# EAGLE design coolingcontrol (EAGLE 9.1.3)
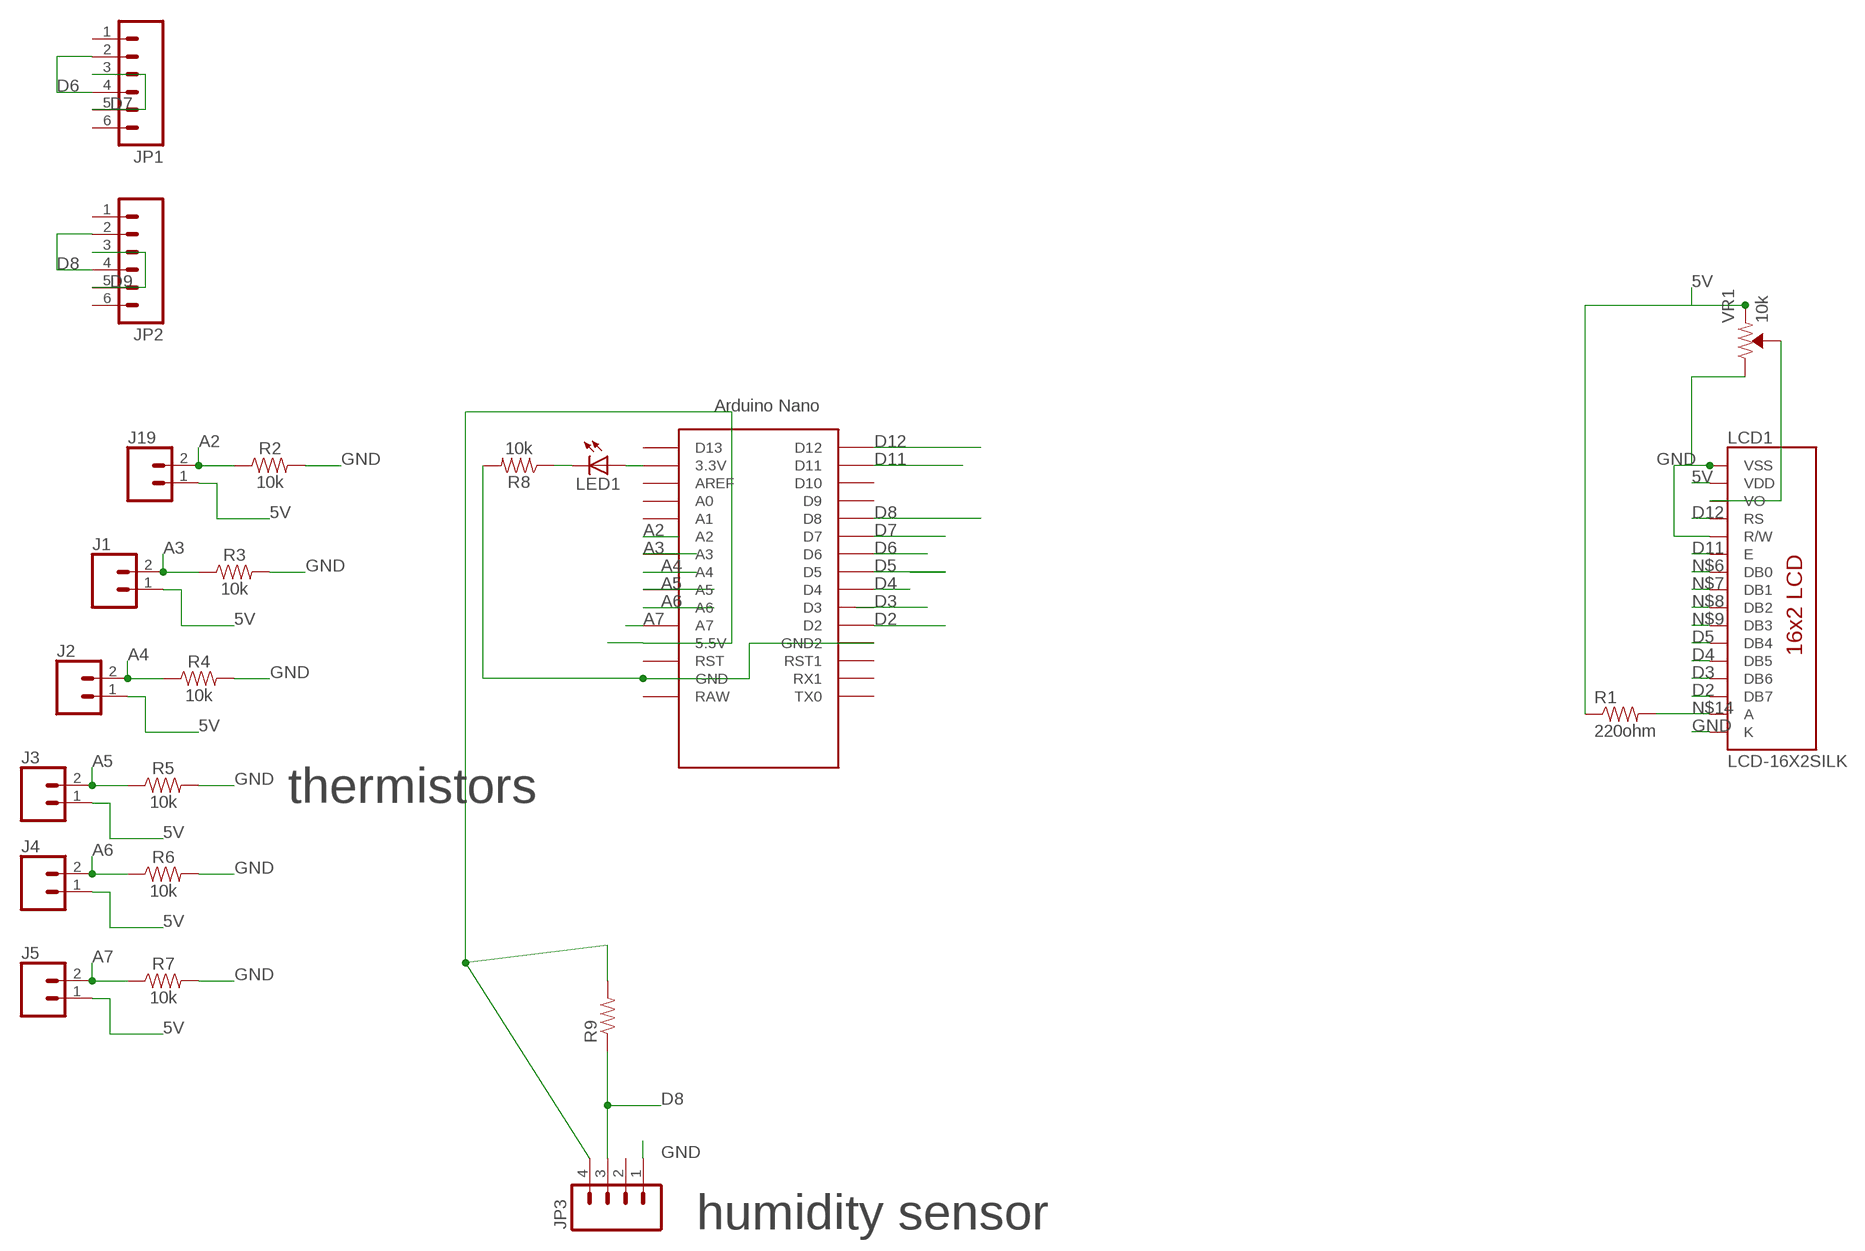
[diagram p0: schematic, sheet 1]

## Parts
J1  CONN_02-JST-2-PTH-NO_SILK  [JST-2-PTH-NS]
J2  CONN_02-JST-2-PTH-NO_SILK  [JST-2-PTH-NS]
J3  CONN_02-JST-2-PTH-NO_SILK  [JST-2-PTH-NS]
J4  CONN_02-JST-2-PTH-NO_SILK  [JST-2-PTH-NS]
J5  CONN_02-JST-2-PTH-NO_SILK  [JST-2-PTH-NS]
J19  CONN_02-JST-2-PTH-NO_SILK  [JST-2-PTH-NS]
JP1  M06POLAR  [MOLEX-1X6]
JP2  M06POLAR  [MOLEX-1X6]
JP3  M04PTH  [1X04]
LCD1  LCD-16X2SILK  [LCD-16X2]
LED1  LED5MM  [LED5MM]
R1  220ohm  RESISTORPTH1  [AXIAL-0.3]
R2  10k  10KOHM-HORIZ-1/4W-1%  [AXIAL-0.3]
R3  10k  10KOHM-HORIZ-1/4W-1%  [AXIAL-0.3]
R4  10k  10KOHM-HORIZ-1/4W-1%  [AXIAL-0.3]
R5  10k  10KOHM-HORIZ-1/4W-1%  [AXIAL-0.3]
R6  10k  10KOHM-HORIZ-1/4W-1%  [AXIAL-0.3]
R7  10k  10KOHM-HORIZ-1/4W-1%  [AXIAL-0.3]
R8  10k  10KOHM-HORIZ-1/4W-1%  [AXIAL-0.3]
R9  RESISTORPTH1  [AXIAL-0.3]
U$1  NANO  [NANO]
VR1  10k  TRIMPOT-PTH-10MM-KNOB-1/2W-10%  [TRIMPOT-PTH-3386U]

## Nets
5V: J1.1 J2.1 J3.1 J4.1 J5.1 J19.1 JP3.4 LCD1.2(VDD) R1.P$1 R9.P$2 U$1.5V(5.5V) VR1.1(CCW)
A2: J19.2 R2.P$1 U$1.A2
A3: J1.2 R3.P$1 U$1.A3
A4: J2.2 R4.P$1 U$1.A4
A5: J3.2 R5.P$1 U$1.A5
A6: J4.2 R6.P$1 U$1.A6
A7: J5.2 R7.P$1 U$1.A7
D2: LCD1.14(DB7) U$1.D2
D3: LCD1.13(DB6) U$1.D3
D4: LCD1.12(DB5) U$1.D4
D5: LCD1.11(DB4) U$1.D5
D6: JP1.2 JP1.4 U$1.D6
D7: JP1.3 JP1.5 U$1.D7
D8: JP2.2 JP2.4 JP3.3 R9.P$1 U$1.D8
D9: JP2.3 JP2.5
D11: LCD1.6(E) U$1.D11
D12: LCD1.4(RS) U$1.D12
GND: JP3.1 LCD1.1(VSS) LCD1.5(R/W) LCD1.16(K) R2.P$2 R3.P$2 R4.P$2 R5.P$2 R6.P$2 R7.P$2 R8.P$2 U$1.GND U$1.GND1(GND2) VR1.3(CW)
N$1: LCD1.3(VO) VR1.2(WIPER)
N$3: LED1.K(C) R8.P$1
N$4: LED1.A U$1.3.3V
N$6: LCD1.7(DB0)
N$7: LCD1.8(DB1)
N$8: LCD1.9(DB2)
N$9: LCD1.10(DB3)
N$14: LCD1.15(A) R1.P$2
Unconnected: JP1.1 JP1.6 JP2.1 JP2.6 JP3.2 U$1.A0 U$1.A1 U$1.AREF U$1.D9 U$1.D10 U$1.D13 U$1.ICSP1 U$1.ICSP2 U$1.ICSP3 U$1.ICSP4 U$1.ICSP5 U$1.ICSP6 U$1.RAW U$1.RST U$1.RST1 U$1.RX1 U$1.TX0

## Notes on the sheet
- thermistors
- humidity sensor

## Library data of the parts
J1-J5 J19 = SparkFun-Connectors:CONN_02: Multi connection point. Often used as Generic Header-pin footprint for 0.1 inch spaced/style header connections On any of the 0.1 inch spaced packages, you can populate with these: Break Away Headers - Straight <https://www.sparkfun.com/products/116> (PRT-00116) Break Away Male Headers - Right Angle <https://www.sparkfun.com/products/553> (PRT-00553) Female Headers <https://www.sparkfun.com/products/115> (PRT-00115) Break Away Headers - Machine Pin <https://www.sparkfun.com/products/117> (PRT-00117) Break Away Female Headers - Swiss Machine Pin <https://www.sparkfun.com/products/743> (PRT-00743) For SCREWTERMINALS and SPRING TERMINALS visit here: Screw Terimnals on SparkFun.com <https://www.sparkfun.com/search/results?term=Screw+Terminals> (5mm/3.5mm/2.54mm spacing) This device is also useful as a general connection point to wire up your design to another part of your project. Our various solder wires solder well into these plated through hole pads. Hook-Up Wire - Assortment (Stranded, 22 AWG) <https://www.sparkfun.com/products/11375> (PRT-11375) Hook-Up Wire - Assortment (Solid Core, 22 AWG) <https://www.sparkfun.com/products/11367> (PRT-11367) View the entire wire category on our website here <https://www.sparkfun.com/categories/141> Special notes: Molex polarized connector foot print use with: PRT-08233 with associated crimp pins and housings. 2.54_SCREWTERM for use with PRT-10571. 3.5mm Screw Terminal footprints for PRT-08084 5mm Screw Terminal footprints for use with PRT-08432; OC_NEWARK: unknown
JP1 JP2 = SparkFun:M06: Header 6 Standard 6-pin 0.1" header. Use with straight break away headers (SKU : PRT-00116), right angle break away headers (PRT-00553), swiss pins (PRT-00743), machine pins (PRT-00117), and female headers (PRT-00115). Molex polarized connector foot print use with SKU : PRT-08094 with associated crimp pins and housings. NOTES ON THE VARIANTS LOCK and LOCK_LONGPADS... This footprint was designed to help hold the alignment of a through-hole component (i.e. 6-pin header) while soldering it into place. You may notice that each hole has been shifted either up or down by 0.005 of an inch from it's more standard position (which is a perfectly straight line). This slight alteration caused the pins (the squares in the middle) to touch the edges of the holes. Because they are alternating, it causes a "brace" to hold the component in place. 0.005 has proven to be the perfect amount of "off-center" position when using our standard breakaway headers. Although looks a little odd when you look at the bare footprint, once you have a header in there, the alteration is very hard to notice. Also, if you push a header all the way into place, it is covered up entirely on the bottom side. This idea of altering the position of holes to aid alignment will be further integrated into the Sparkfun Library for other footprints. It can help hold any component with 3 or more connection pins.; OC_NEWARK: unknown
JP3 = SparkFun:M04: Header 4 Standard 4-pin 0.1" header. Use with straight break away headers (SKU : PRT-00116), right angle break away headers (PRT-00553), swiss pins (PRT-00743), machine pins (PRT-00117), and female headers (PRT-00115). Molex polarized connector foot print use with SKU : PRT-08231 with associated crimp pins and housings.
LCD1 = SparkFun-Displays:LCD-16X2: Standard text-only 16x2 parallel input LCD Basic 16 character by 2 line display. Typically utilizes the extremely common HD44780 parallel interface chipset SparkFun Products: Basic 16x2 Green <https://www.sparkfun.com/products/255> Basic 8x2 Green <https://www.sparkfun.com/products/11122>; OC_NEWARK: unknown; SF_ID: LCD-00255
LED1 = adafruit:LED: LED OSRAM: - CHIPLED LG R971, LG N971, LY N971, LG Q971, LY Q971, LO R971, LY R971 LH N974, LH R974 LS Q976, LO Q976, LY Q976 LO Q996 - Hyper CHIPLED LW Q18S LB Q993, LB Q99A, LB R99A - SideLED LS A670, LO A670, LY A670, LG A670, LP A670 LB A673, LV A673, LT A673, LW A673 LH A674 LY A675 LS A676, LA A676, LO A676, LY A676, LW A676 LS A679, LY A679, LG A679 - Hyper Micro SIDELED® LS Y876, LA Y876, LO Y876, LY Y876 LT Y87S - SmartLED LW L88C, LW L88S LB L89C, LB L89S, LG L890 LS L89K, LO L89K, LY L89K LS L896, LA L896, LO L896, LY L896 - TOPLED LS T670, LO T670, LY T670, LG T670, LP T670 LSG T670, LSP T670, LSY T670, LOP T670, LYG T670 LG T671, LOG T671, LSG T671 LB T673, LV T673, LT T673, LW T673 LH T674 LS T676, LA T676, LO T676, LY T676, LB T676, LH T676, LSB T676, LW T676 LB T67C, LV T67C, LT T67C, LS T67K, LO T67K, LY T67K, LW E67C LS E67B, LA E67B, LO E67B, LY E67B, LB E67C, LV E67C, LT E67C LW T67C LS T679, LY T679, LG T679 LS T770, LO T770, LY T770, LG T770, LP T770 LB T773, LV T773, LT T773, LW T773 LH T774 LS E675, LA E675, LY E675, LS T675 LS T776, LA T776, LO T776, LY T776, LB T776 LHGB T686 LT T68C, LB T68C - Hyper Mini TOPLED® LB M676 - Mini TOPLED Santana® LG M470 LS M47K, LO M47K, LY M47K Source: http://www.osram.convergy.de/; OC_NEWARK: unknown
R1 = SparkFun:RESISTOR: Resistor Basic schematic elements and footprints for 0603, 1206, and PTH 1/10th watt (small) resistors.; OC_NEWARK: unknown
R2-R8 = SparkFun-Resistors:10KOHM: 10kΩ resistor A resistor is a passive two-terminal electrical component that implements electrical resistance as a circuit element. Resistors act to reduce current flow, and, at the same time, act to lower voltage levels within circuits. - Wikipedia; OC_NEWARK: unknown; PROD_ID: RES-12183
R9 = SparkFun:RESISTOR: Resistor Basic schematic elements and footprints for 0603, 1206, and PTH 1/10th watt (small) resistors.
U$1 = Arduino-clone:NANO: Arduino Nano
VR1 = SparkFun-Resistors:TRIMPOT: Trimming Potentiometer (Trimpot) Three-terminal potentiometers, with an adjustable wiper and two adjustable resistors. A pot can be used to create a configurable voltage divider, or as a variable resistor. "Trimpots" are a subset of potentiometers, usually intended for "set-and-forget" applications. They're often more delicate than standard potentiometers - rated for fewer turns. Variants PTH-KNOB - PTH Trimpot w/ finger-adjustable knob Trimpot 10K with Knob <https://www.sparkfun.com/products/9806> (COM-09806) Datasheet <http://www.sparkfun.com/datasheets/Components/General/TSR-3386.pdf> SMD-3MM-CLOSED-FRAME - SMD 3mm Square Closed-Frame Trimpot Used on e.g. EasyDriver - Stepper Motor Driver <https://www.sparkfun.com/products/12779> Datasheet <http://www.bitechnologies.com/pdfs/22.pdf> (22AR10KTR) SMD-5MM - SMD 5mm Square Closed-Frame Trimpot Used on e.g. IOIO-OTG - V2.2 <https://www.sparkfun.com/products/13613> Datasheet <http://www.vishay.com/docs/51008/ts53.pdf> (TS53YL502MR10) SMD-3MM-1/10W-25% - 3mm Square Open-Frame Trimpot Used on e.g. SparkFun Shapeoko <https://www.sparkfun.com/products/13899> Datasheet <http://www.bourns.com/docs/Product-Datasheets/TC33.pdf> (TC33X-2-103E); OC_NEWARK: unknown; PROD_ID: RES-09730; SF_SKU: COM-09806

## Board
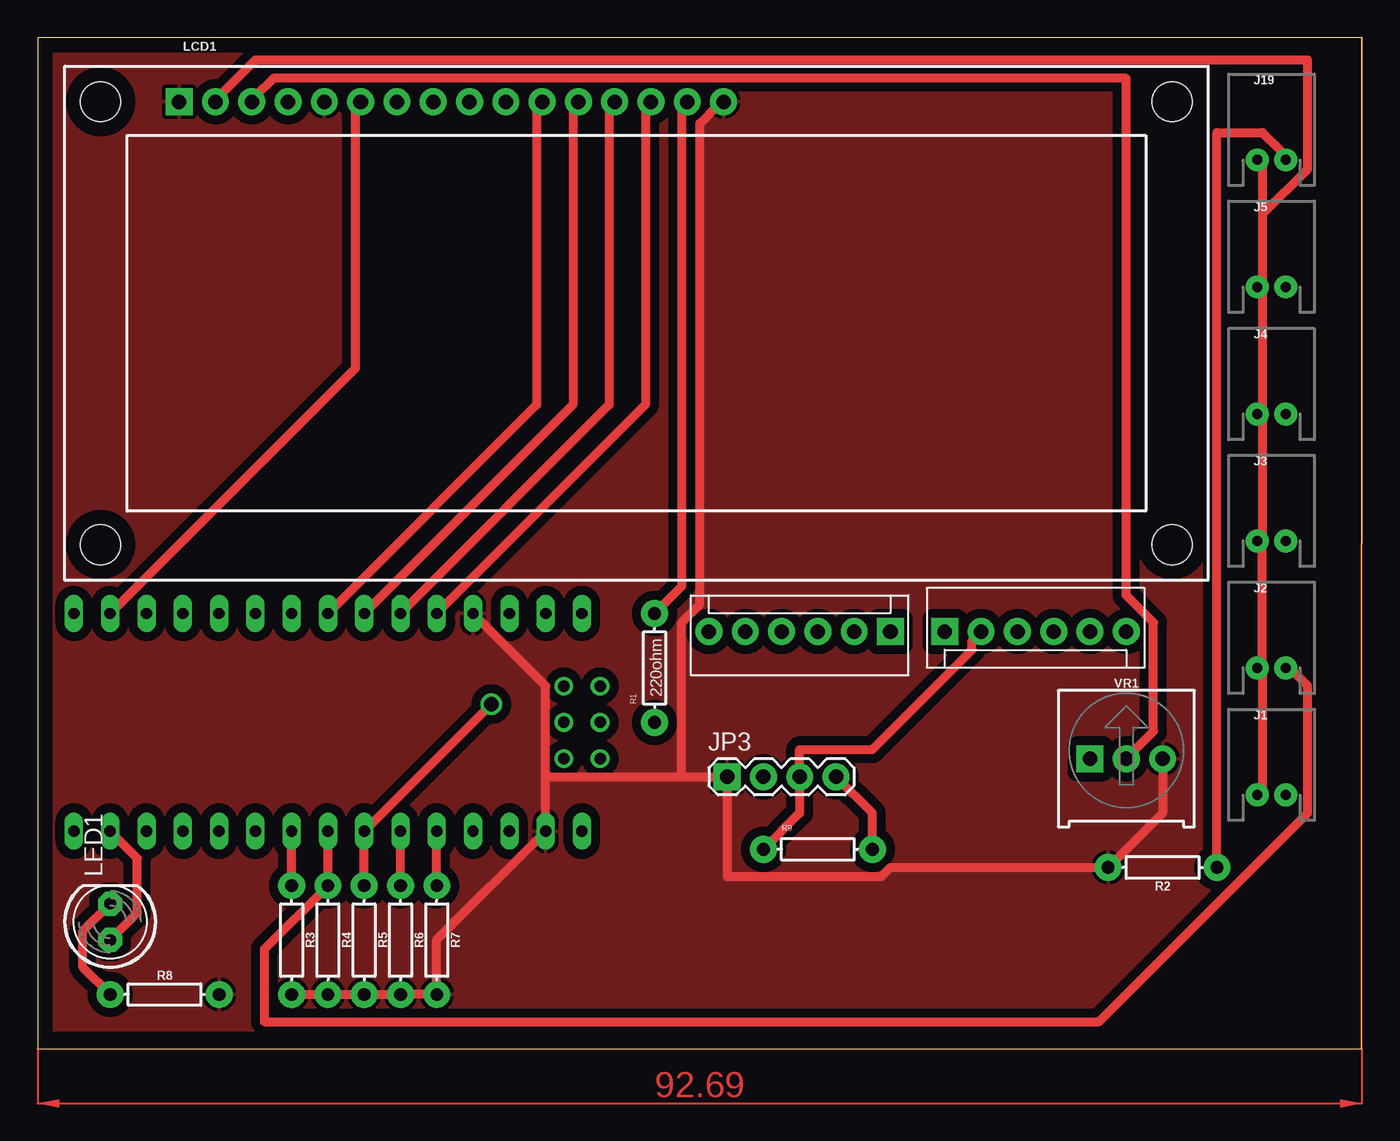
[diagram p1: board, top side]
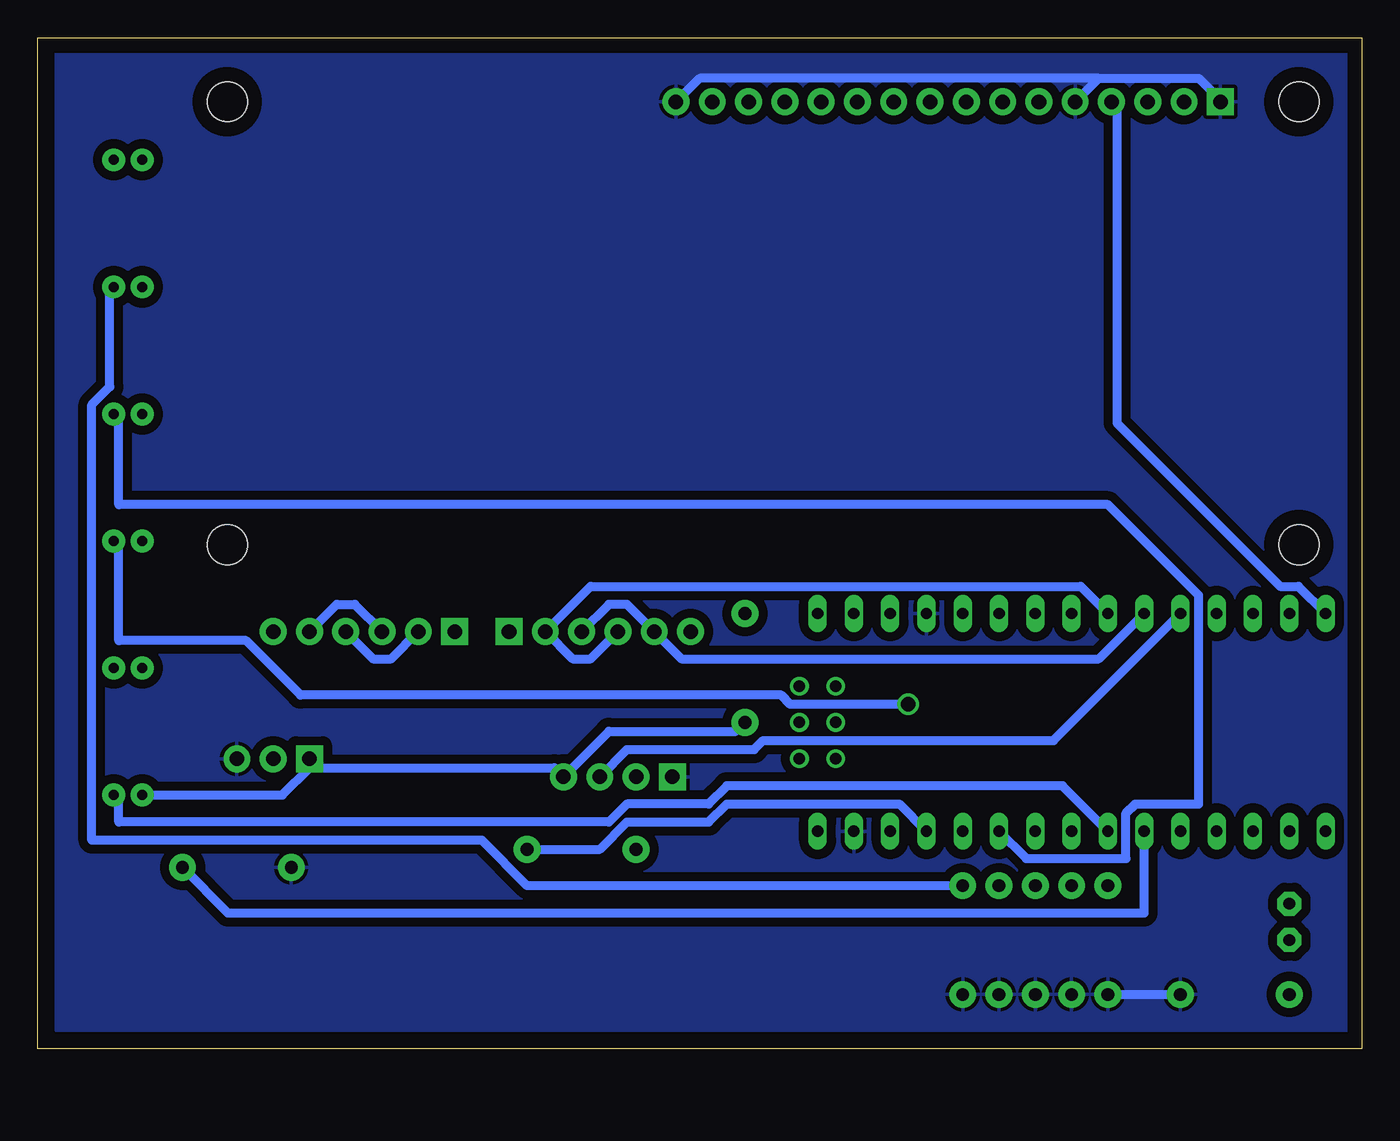
[diagram p2: board, bottom side, seen from below]

Size 92.69 x 70.79 mm. Coordinates in mm from the lower left corner, seen from the top.
Outline: 0,0 92.69,0 92.69,70.79 0,70.79 0,0
Copper layers (1*16): Top 0.035mm / dielectric 1.5mm / Bottom 0.035mm
Design rules "default *": minimum track width 25mil, minimum drill 1mm, track to track 25mil, track to pad 25mil, pad to pad 25mil, via to via 25mil, smd to smd 0mil, copper to edge 40mil, drill to drill 6mil, minimum pad ring 10mil, minimum via ring 8mil, stop-mask expansion 4mil, vias tented up to drill 0mil, thermal gap 10mil

### Footprints (pad centres in the part's own frame; a part is rotated, then mirrored left to right if it is on the bottom)
JST-2-PTH-NS = drill 0.7 pad 1.6: 1 -1,0; 2 1,0
MOLEX-1X6 = drill 1.016 pad 1.88 square: 1 0,0 | drill 1.016 pad 1.88: 2 2.54,0; 3 5.08,0; 4 7.62,0; 5 10.16,0; 6 12.7,0
1X04 = drill 1.016 pad 1.88 square: 1 0,0 | drill 1.016 pad 1.88: 2 2.54,0; 3 5.08,0; 4 7.62,0
LCD-16X2 = drill 1.016 pad 1.88 square: 1 -32,15.5 | drill 1.016 pad 1.88: 2 -29.46,15.5; 3 -26.92,15.5; 4 -24.38,15.5; 5 -21.84,15.5; 6 -19.3,15.5; 7 -16.76,15.5; 8 -14.22,15.5; 9 -11.68,15.5; 10 -9.14,15.5; 11 -6.6,15.5; 12 -4.06,15.5; 13 -1.52,15.5; 14 1.02,15.5; 15 3.56,15.5; 16 6.1,15.5 | hole 2.8: -37.5,15.5; -37.5,-15.5; 37.5,15.5; 37.5,-15.5
LED5MM = drill 0.813 pad 1.676 octagon: A -1.27,0; K 1.27,0
AXIAL-0.3 = drill 0.9 pad 1.88: P$1 -3.81,0; P$2 3.81,0
NANO = drill 0.8 long: 3.3V -10.16,24.13; 5V -10.16,-1.27; A0 -10.16,19.05; A1 -10.16,16.51; A2 -10.16,13.97; A3 -10.16,11.43; A4 -10.16,8.89; A5 -10.16,6.35; A6 -10.16,3.81; A7 -10.16,1.27; AREF -10.16,21.59; D2 5.08,1.27; D3 5.08,3.81; D4 5.08,6.35; D5 5.08,8.89; D6 5.08,11.43; D7 5.08,13.97; D8 5.08,16.51; D9 5.08,19.05; D10 5.08,21.59; D11 5.08,24.13; D12 5.08,26.67; D13 -10.16,26.67; GND -10.16,-6.35; GND1 5.08,-1.27; RAW -10.16,-8.89; RST -10.16,-3.81; RST1 5.08,-3.81; RX1 5.08,-6.35; TX0 5.08,-8.89 | drill 0.8: ICSP1 -5.08,-10.16; ICSP2 -5.08,-7.62; ICSP3 -2.54,-10.16; ICSP4 -2.54,-7.62; ICSP5 0,-10.16; ICSP6 0,-7.62
TRIMPOT-PTH-3386U = drill 1.016 pad 1.88 square: 1 -2.54,-0.015 | drill 1.016 pad 1.88: 2 0,-0.015; 3 2.54,-0.015

### Placement (x,y rotation side)
J1  86.36,17.78 0 top
J2  86.36,26.67 0 top
J3  86.36,35.56 0 top
J4  86.36,44.45 0 top
J5  86.36,53.34 0 top
J19  86.36,62.23 0 top
JP1  59.69,29.21 180 top
JP2  63.5,29.21 0 top
JP3  48.26,19.05 0 top
LCD1  41.91,50.8 0 top
LED1  5.08,8.89 90 top
R1  43.18,26.67 90 top
R2  78.74,12.7 180 top
R3  17.78,7.62 270 top
R4  20.32,7.62 270 top
R5  22.86,7.62 270 top
R6  25.4,7.62 270 top
R7  27.94,7.62 270 top
R8  8.89,3.81 0 top
R9  54.61,13.97 0 top
U$1  29.21,25.4 90 top
VR1  76.2,20.32 0 top

### Tracks (layer width: path | path; a pad name or v marks a point on that pad's centre or on a via)
5V
  Top 0.635: JP3.4 58.42,16.51 R9.P$2 | 85.72,44.45 85.72,35.56 | 85.72,26.67 85.72,17.78 J1.1 | 85.72,26.67 85.72,35.56 | 85.72,35.56 J3.1 | 85.72,26.67 J2.1 | 85.72,58.42 85.72,62.23 J19.1 | 85.72,58.42 85.72,53.34 | 85.72,58.42 88.9,61.6 88.9,69.22 15.24,69.22 12.7,66.68 LCD1.2 | 85.72,53.34 85.72,44.45 | 85.72,44.45 J4.1 | 85.72,53.34 J5.1
  Bottom 0.635: U$1.5V 32.38,17.14 44.45,17.14 45.72,15.88 51.44,15.88 53.34,13.97 R9.P$2 | R1.P$1 43.81,22.23 52.7,22.23 JP3.4 56.52,19.69 73.66,19.69 | 73.66,19.69 75.56,17.78 J1.1 | 73.66,19.69 VR1.1
A2
  Top 0.635: R2.P$1 82.55,64.13 85.72,64.13 87,62.87 87,62.23 J19.2
  Bottom 0.635: U$1.A2 15.24,9.52 79.38,9.52 R2.P$1
A3
  Top 0.635: R3.P$1 U$1.A3
  Bottom 0.635: U$1.A3 20.95,18.41 44.45,18.41 45.72,17.14 51.44,17.14 52.7,15.88 87,15.88 87,17.78 J1.2
A4
  Top 0.635: U$1.A4 R4.P$1 15.88,6.98 15.88,1.9 74.3,1.9 88.9,16.51 88.9,25.4 87.63,26.67 J2.2
A5  (via drill 1)
  Top 0.635: R5.P$1 U$1.A5 v31.75,24.13
  Bottom 0.635: v31.75,24.13 40.01,24.13 40.64,24.77 74.3,24.77 78.11,28.57 87,28.57 87,35.56 J3.2
A6
  Top 0.635: R6.P$1 U$1.A6
  Bottom 0.635: U$1.A6 23.5,13.34 16.51,13.34 16.51,16.51 15.88,17.14 11.43,17.14 11.43,31.75 17.78,38.1 87,38.1 87,44.45 J4.2
A7
  Top 0.635: R7.P$1 U$1.A7
  Bottom 0.635: R7.P$1 58.42,11.43 61.59,14.6 88.9,14.6 88.9,45.09 87.63,46.35 87.63,53.34 J5.2
D2
  Top 0.635: U$1.D2 42.55,45.09 42.55,66.04 LCD1.14
D3
  Top 0.635: U$1.D3 40.01,45.09 40.01,66.04 LCD1.13
D4
  Top 0.635: U$1.D4 37.47,45.09 37.47,66.04 LCD1.12
D5
  Top 0.635: U$1.D5 34.92,45.09 34.92,66.04 LCD1.11
D6
  Bottom 0.635: U$1.D6 19.68,32.38 53.98,32.38 JP1.2 55.24,27.3 53.98,27.3 JP1.4
D7
  Bottom 0.635: U$1.D7 18.41,27.3 47.62,27.3 JP1.5 51.44,31.12 52.7,31.12 JP1.3
D8
  Top 0.635: R9.P$1 53.34,16.51 JP3.3 53.34,20.95 58.42,20.95 65.41,27.94 65.41,28.57 JP2.2
  Bottom 0.635: JP2.2 67.94,27.3 69.22,27.3 JP2.4 | U$1.D8 21.59,21.59 41.91,21.59 42.55,20.95 51.44,20.95 JP3.3
D9
  Bottom 0.635: JP2.3 70.48,31.12 71.75,31.12 JP2.5
D11
  Top 0.635: U$1.D11 22.23,47.62 22.23,66.04 LCD1.6
D12
  Bottom 0.635: U$1.D12 4.45,32.38 5.71,32.38 17.14,43.82 17.14,66.04 LCD1.4
GND
  Top 0.635: R3.P$2 R4.P$2 R5.P$2 R6.P$2 R7.P$2 27.94,7.62 U$1.GND 35.56,19.05 | VR1.3 78.74,16.51 R2.P$2 59.69,12.7 59.05,12.06 48.26,12.06 JP3.1 45.09,19.05 | U$1.GND1 35.56,25.4 35.56,19.05 | 35.56,19.05 45.09,19.05 | 45.09,19.05 45.09,29.84 46.35,31.12 46.35,64.77 47.62,66.04 LCD1.16
  Bottom 0.635: 18.41,67.94 11.43,67.94 10.16,66.68 LCD1.1 | 18.41,67.94 19.68,66.68 LCD1.5 | 18.41,67.94 46.35,67.94 47.62,66.68 LCD1.16 | R3.P$2 R8.P$2
  pour Top: 91.44,69.85 91.44,1.27 0,1.27 0,69.85
  pour Bottom: 0,69.85 91.44,69.85 91.44,1.27 0,1.27
N$1
  Top 0.635: LCD1.3 15.24,66.68 16.51,67.94 76.2,67.94 76.2,31.75 78.11,29.84 78.11,22.23 VR1.2
N$3
  Top 0.635: LED1.K 3.17,8.26 3.17,5.71 R8.P$1
N$4
  Top 0.635: U$1.3.3V 6.99,13.34 6.99,9.52 LED1.A
N$14
  Top 0.635: R1.P$2 45.09,32.38 45.09,66.04 LCD1.15
(copper drawn outside any net)
  shapes: Top area x2